# Altium schematic sheet GCM_SCH.SchDoc
size C; SheetNumber: 1; SheetTotal: 1
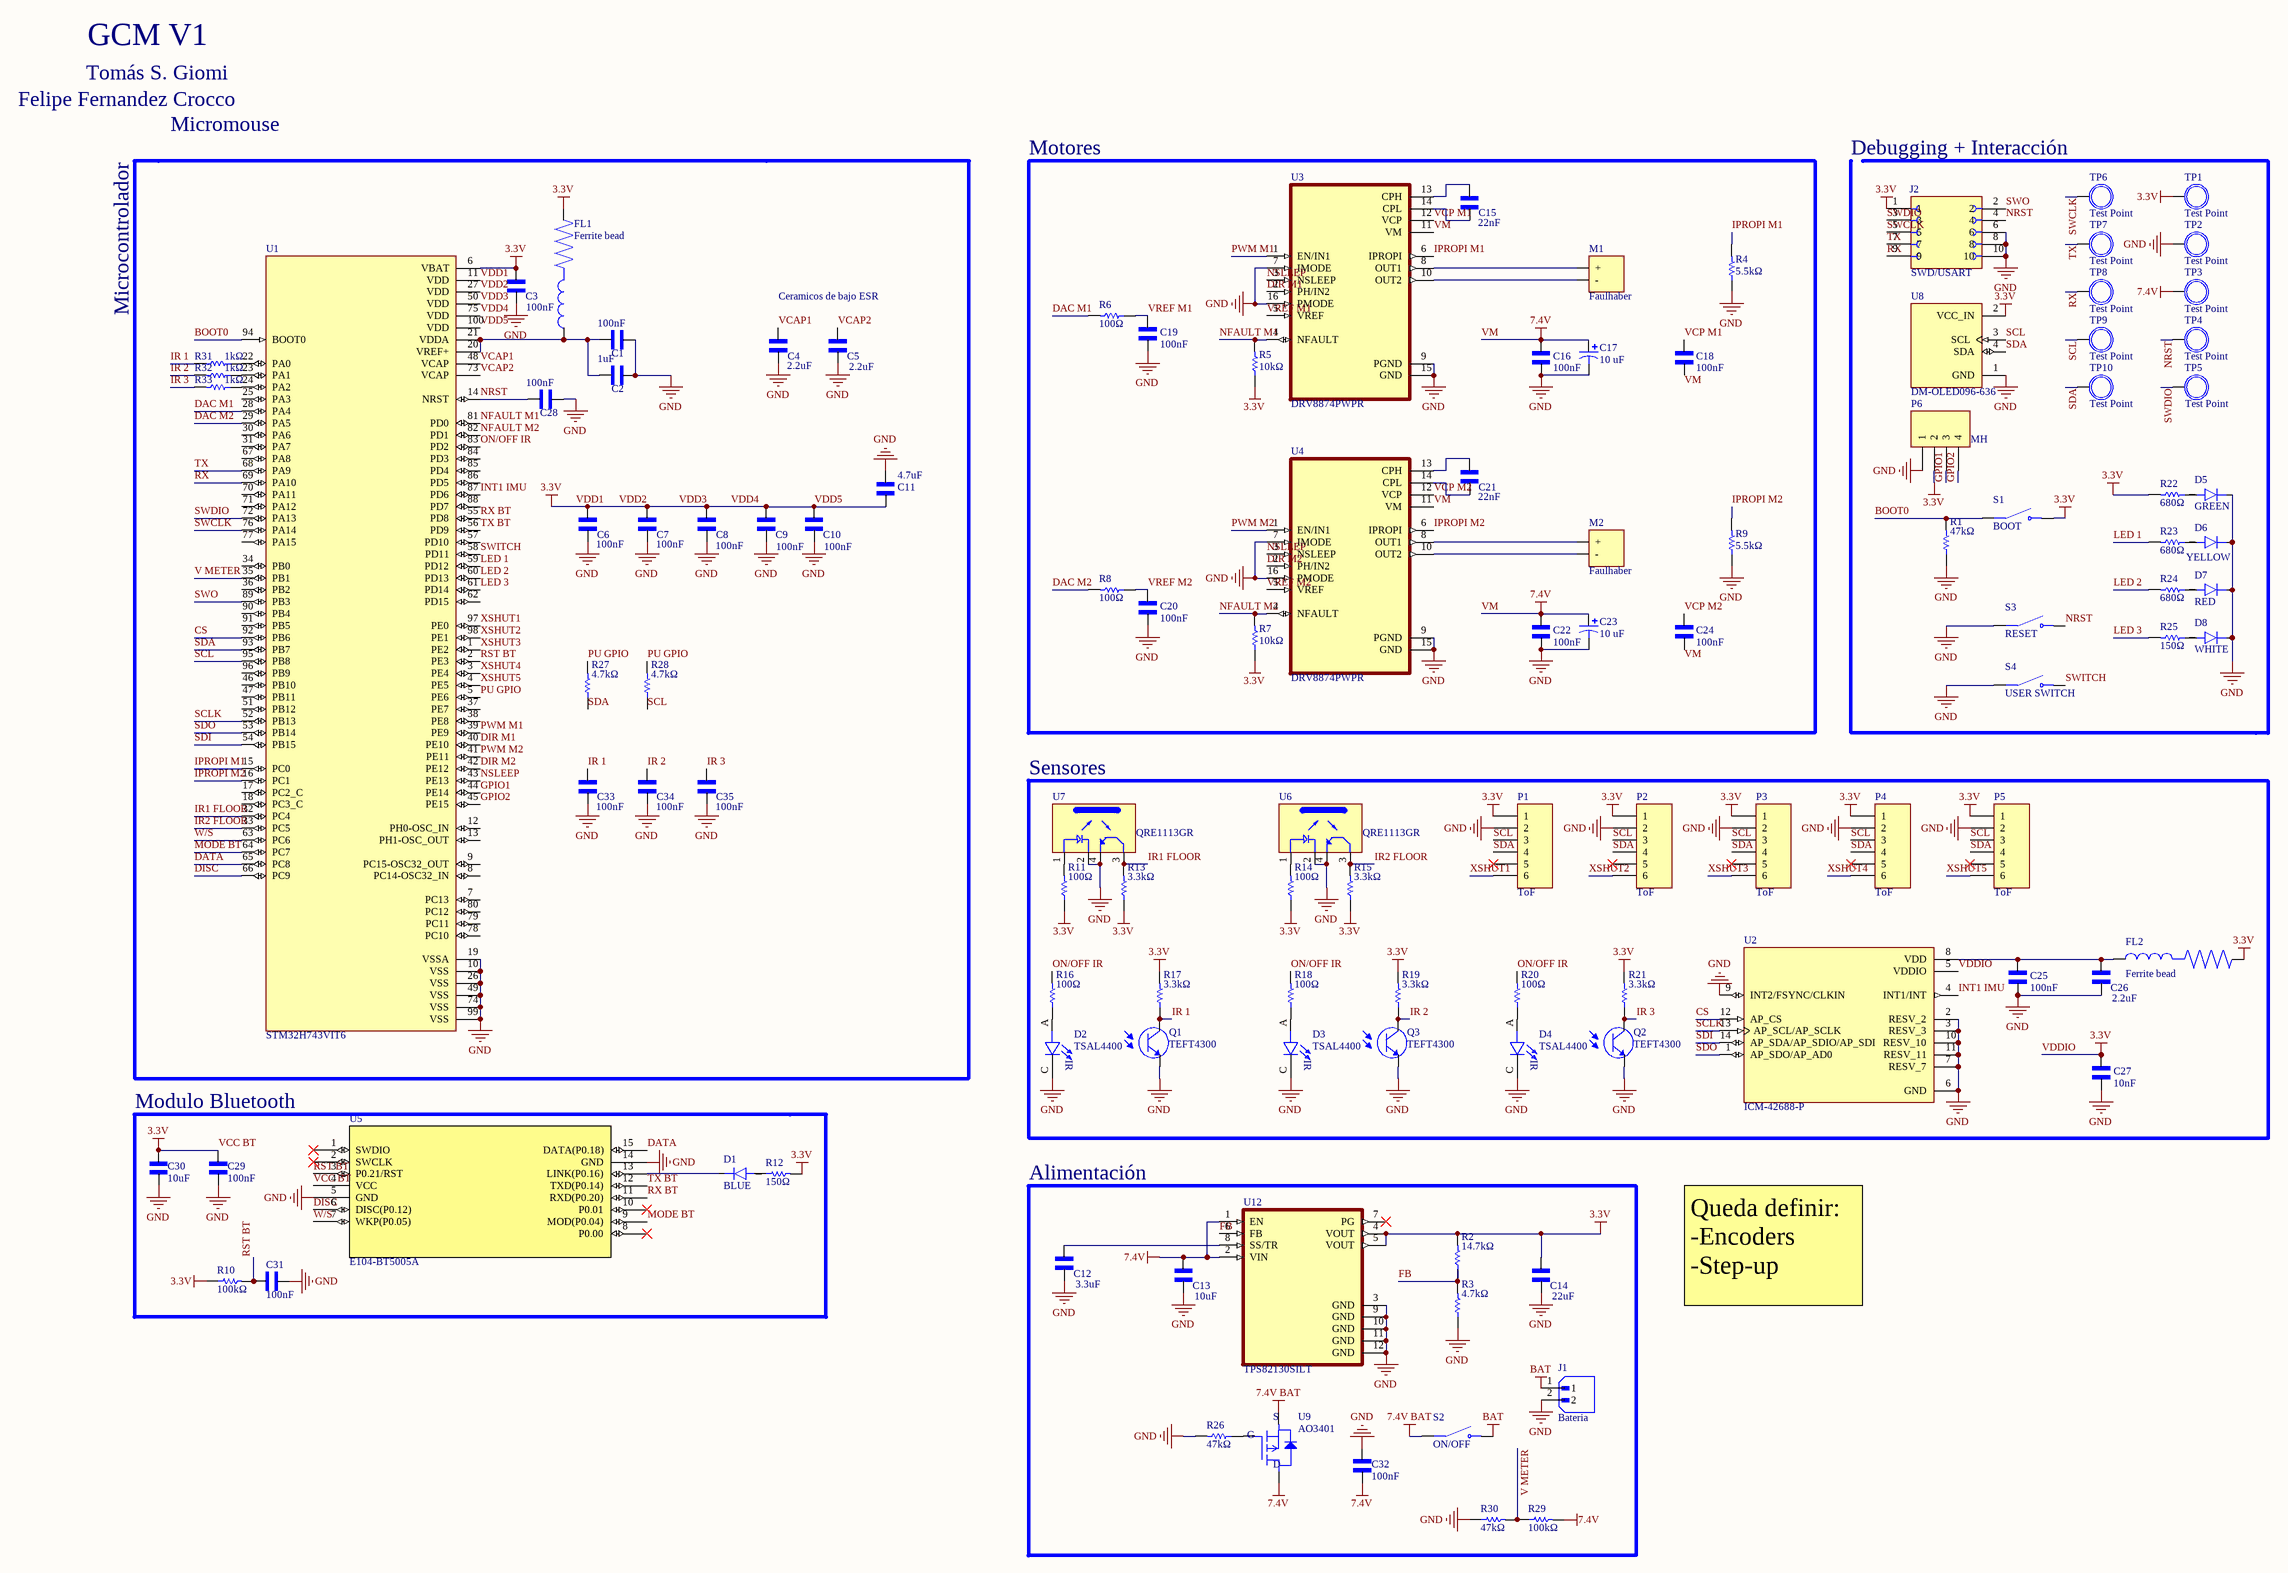
[diagram p0: GCM_SCH.SchDoc]

## Parts
C1  100nF  [CAPACITOR TANTALIO]
C2  1uF  [CAPACITOR TANTALIO]
C3  100nF  [CAPACITOR TANTALIO]
C4  2.2uF  [CAPACITOR TANTALIO]
C5  2.2uF  [CAPACITOR TANTALIO]
C6  100nF  [CAPACITOR TANTALIO]
C7  100nF  [CAPACITOR TANTALIO]
C8  100nF  [CAPACITOR TANTALIO]
C9  100nF  [CAPACITOR TANTALIO]
C10  100nF  [CAPACITOR TANTALIO]
C11  4.7uF  [CAPACITOR TANTALIO]
C12  3.3uF  [CAPACITOR TANTALIO]
C13  10uF  [CAPACITOR TANTALIO]
C14  22uF  [CAPACITOR TANTALIO]
C15  22nF  [CAPACITOR TANTALIO]
C16  100nF  [CAPACITOR TANTALIO]
C17  10 uF  [Cap El 10uF]
C18  100nF  [CAPACITOR TANTALIO]
C19  100nF  [CAPACITOR TANTALIO]
C20  100nF  [CAPACITOR TANTALIO]
C21  22nF  [CAPACITOR TANTALIO]
C22  100nF  [CAPACITOR TANTALIO]
C23  10 uF  [Cap El 10uF]
C24  100nF  [CAPACITOR TANTALIO]
C25  100nF  [CAPACITOR TANTALIO]
C26  2.2uF  [CAPACITOR TANTALIO]
C27  10nF  [CAPACITOR TANTALIO]
C28  100nF  [CAPACITOR TANTALIO]
C29  100nF  [CAPACITOR TANTALIO]
C30  10uF  [CAPACITOR TANTALIO]
C31  100nF  [CAPACITOR TANTALIO]
C32  100nF  [CAPACITOR TANTALIO]
C33  100nF  [CAPACITOR TANTALIO]
C34  100nF  [CAPACITOR TANTALIO]
C35  100nF  [CAPACITOR TANTALIO]
D1  BLUE  [LED SMD]
D2  TSAL4400  [LEDRD254W45D335H610]
D3  TSAL4400  [LEDRD254W45D335H610]
D4  TSAL4400  [LEDRD254W45D335H610]
D5  GREEN  [LED SMD]
D6  YELLOW  [LED SMD]
D7  RED  [LED SMD]
D8  WHITE  [LED SMD]
FL1  Ferrite bead  [BEADC1608X95N]
FL2  Ferrite bead  [BEADC1608X95N]
J1  Bateria  [JST_B2B-XH-A]
J2  SWD/USART  [AMPHENOL_20021311-00026T4LF]
M1  Faulhaber  [MOTOR]
M2  Faulhaber  [MOTOR]
P1  ToF  [FHDR1X6]
P2  ToF  [FHDR1X6]
P3  ToF  [FHDR1X6]
P4  ToF  [FHDR1X6]
P5  ToF  [FHDR1X6]
P6  MH  [FHDR1X4]
Q1  TEFT4300  [XDCR_TEFT4300]
Q2  TEFT4300  [XDCR_TEFT4300]
Q3  TEFT4300  [XDCR_TEFT4300]
R1  47kΩ  [RESISTENCIA SMD]
R2  14.7kΩ  [RESISTENCIA SMD]
R3  4.7kΩ  [RESISTENCIA SMD]
R4  5.5kΩ  [RESISTENCIA SMD]
R5  10kΩ  [RESISTENCIA SMD]
R6  100Ω  [RESISTENCIA SMD]
R7  10kΩ  [RESISTENCIA SMD]
R8  100Ω  [RESISTENCIA SMD]
R9  5.5kΩ  [RESISTENCIA SMD]
R10  100kΩ  [RESISTENCIA SMD]
R11  100Ω  [RESISTENCIA SMD]
R12  150Ω  [RESISTENCIA SMD]
R13  3.3kΩ  [RESISTENCIA SMD]
R14  100Ω  [RESISTENCIA SMD]
R15  3.3kΩ  [RESISTENCIA SMD]
R16  100Ω  [RESISTENCIA SMD]
R17  3.3kΩ  [RESISTENCIA SMD]
R18  100Ω  [RESISTENCIA SMD]
R19  3.3kΩ  [RESISTENCIA SMD]
R20  100Ω  [RESISTENCIA SMD]
R21  3.3kΩ  [RESISTENCIA SMD]
R22  680Ω  [RESISTENCIA SMD]
R23  680Ω  [RESISTENCIA SMD]
R24  680Ω  [RESISTENCIA SMD]
R25  150Ω  [RESISTENCIA SMD]
R26  47kΩ  [RESISTENCIA SMD]
R27  4.7kΩ  [RESISTENCIA SMD]
R28  4.7kΩ  [RESISTENCIA SMD]
R29  100kΩ  [RESISTENCIA SMD]
R30  47kΩ  [RESISTENCIA SMD]
R31  1kΩ  [RESISTENCIA SMD]
R32  1kΩ  [RESISTENCIA SMD]
R33  1kΩ  [RESISTENCIA SMD]
S1  BOOT  [SW_TS09-63-25-WT-160-SMT-TR]
S2  ON/OFF  [SW_L101011ML04Q]
S3  RESET  [SW_TS09-63-25-WT-160-SMT-TR]
S4  USER SWITCH  [SW_TS09-63-25-WT-160-SMT-TR]
TP1  Test Point  [TestPoint]  (no BOM)
TP2  Test Point  [TestPoint]  (no BOM)
TP3  Test Point  [TestPoint]  (no BOM)
TP4  Test Point  [TestPoint]  (no BOM)
TP5  Test Point  [TestPoint]  (no BOM)
TP6  Test Point  [TestPoint]  (no BOM)
TP7  Test Point  [TestPoint]  (no BOM)
TP8  Test Point  [TestPoint]  (no BOM)
TP9  Test Point  [TestPoint]  (no BOM)
TP10  Test Point  [TestPoint]  (no BOM)
U1  STM32H743VIT6  [QFP50P1600X1600X160-100N]
U2  ICM-42688-P  [PQFN50P300X250X97-14N]
U3  DRV8874PWPR  [SOP65P640X120-17N]
U4  DRV8874PWPR  [SOP65P640X120-17N]
U5  E104-BT5005A  [MOD15_E104-BT5005A_BYT]
U6  QRE1113GR  [SOIC180P460X187-4N]
U7  QRE1113GR  [SOIC180P460X187-4N]
U8  DM-OLED096-636  [MODULE_DM-OLED096-636]
U9  AO3401  [SOT23]
U12  TPS82130SILT  [CONV_TPS82140SILR]

## Blocks framed on the sheet
Motores: C15-C24 M1 M2 R4-R9 U3 U4
Sensores: C25-C27 D2-D4 FL2 P1-P5 Q1-Q3 R11 R13-R21 U2 U6 U7
Modulo Bluetooth: C29-C31 D1 R10 R12 U5
Alimentación: C12-C14 C32 J1 R2 R3 R26 R29 R30 S2 U9 U12

## Nets
7.4V BAT: S2.1(COM) U9.2(S)
BAT: J1.1 S2.2(NO)
GND: C1.2 C2.2 C3.1 C4.1 C5.1 C6.1 C7.1 C8.1 C9.1 C10.1 C11.2 C12.1 C13.1 C14.1 C16.1 C17.2 C19.1 C20.1 C22.1 C23.2 C25.1 C26.1 C27.1 C28.2 C29.1 C30.1 C31.1 C32.1 C33.1 C34.1 C35.1 D2.C D3.C D4.C D5.C D6.C D7.C D8.C J1.2 J2.6 J2.8 J2.10 P1.2 P2.2 P3.2 P4.2 P5.2 P6.1 Q1.E Q2.E Q3.E R1.1 R3.1 R4.1 R9.1 R26.2 R30.1 S3.1 S4.1 TP2.1 U1.10(VSS) U1.19(VSSA) U1.26(VSS) U1.49(VSS) U1.74(VSS) U1.99(VSS) U2.2(RESV_2) U2.3(RESV_3) U2.6(GND) U2.7(RESV_7) U2.9(INT2/FSYNC/CLKIN) U2.10(RESV_10) U2.11(RESV_11) U3.7(IMODE) U3.9(PGND) U3.15(GND) U3.16(PMODE) U4.7(IMODE) U4.9(PGND) U4.15(GND) U4.16(PMODE) U5.5(GND) U5.14(GND) U6.2(C) U6.4(ET) U7.2(C) U7.4(ET) U8.1(GND) U12.3(GND) U12.9(GND) U12.10(GND) U12.11(GND) U12.12(GND)
VCC BT: C3.2 C6.2 C7.2 C8.2 C9.2 C10.2 C11.1 C14.2 C27.2 C29.2 C30.2 FL1.2 FL2.2 J2.1 P1.1 P2.1 P3.1 P4.1 P5.1 P6.2 R2.2 R5.1 R7.1 R10.1 R11.1 R12.2 R13.1 R14.1 R15.1 R17.2 R19.2 R21.2 R22.2 S1.2 TP1.1 U1.6(VBAT) U1.11(VDD) U1.27(VDD) U1.50(VDD) U1.75(VDD) U1.100(VDD) U2.5(VDDIO) U5.4(VCC) U8.2(VCC_IN) U12.4(VOUT) U12.5(VOUT)  [also labelled 3.3V, VDD1, VDD2, VDD3, VDD4, VDD5, VDDIO]
VM: C13.2 C16.2 C17.1 C22.2 C23.1 C32.2 R29.2 TP3.1 U3.11(VM) U4.11(VM) U9.3(D) U12.1(EN) U12.2(VIN)  [also labelled 7.4V]
BOOT0: R1.2 S1.1 U1.94(BOOT0)
CS: U1.92(PB6) U2.12(AP_CS)
DAC M1: R6.2 U1.28(PA4)
DAC M2: R8.2 U1.29(PA5)
DATA: U1.65(PC8) U5.15(DATA(P0.18))
DIR M1: U1.40(PE10) U3.2(PH/IN2)
DIR M2: U1.42(PE12) U4.2(PH/IN2)
DISC: U1.66(PC9) U5.6(DISC(P0.12))
FB: R2.1 R3.2 U12.6(FB)
GPIO1: P6.3 U1.44(PE14)
GPIO2: P6.4 U1.45(PE15)
INT1 IMU: U1.87(PD6) U2.4(INT1/INT)
IPROPI M1: R4.2 U1.15(PC0) U3.6(IPROPI)
IPROPI M2: R9.2 U1.16(PC1) U4.6(IPROPI)
IR1 FLOOR: R13.2 U1.32(PC4) U7.3(CT)
IR2 FLOOR: R15.2 U1.33(PC5) U6.3(CT)
IR 1: C33.2 Q1.C R17.1 R31.2
IR 2: C34.2 Q3.C R19.1 R32.2
IR 3: C35.2 Q2.C R21.1 R33.2
LED 1: R23.2 U1.59(PD12)
LED 2: R24.2 U1.60(PD13)
LED 3: R25.2 U1.61(PD14)
MODE BT: U1.64(PC7) U5.9(MOD(P0.04))
NFAULT M1: R5.2 U1.81(PD0) U3.4(NFAULT)
NFAULT M2: R7.2 U1.82(PD1) U4.4(NFAULT)
NRST: C28.1 J2.4 S3.2 TP4.1 U1.14(NRST)
NSLEEP: U1.43(PE13) U3.3(NSLEEP) U4.3(NSLEEP)
ON/OFF IR: R16.2 R18.2 R20.2 U1.83(PD2)
PU GPIO: R27.2 R28.2 U1.5(PE6)
PWM M1: U1.39(PE9) U3.1(EN/IN1)
PWM M2: U1.41(PE11) U4.1(EN/IN1)
RST BT: C31.2 R10.2 U1.2(PE3) U5.3(P0.21/RST)
RX: J2.9 TP8.1 U1.69(PA10)
RX BT: U1.55(PD8) U5.11(RXD(P0.20))
SCL: P1.3 P2.3 P3.3 P4.3 P5.3 R28.1 TP9.1 U1.95(PB8) U8.3(SCL)
SCLK: U1.52(PB13) U2.13(AP_SCL/AP_SCLK)
SDA: P1.4 P2.4 P3.4 P4.4 P5.4 R27.1 TP10.1 U1.93(PB7) U8.4(SDA)
SDI: U1.54(PB15) U2.14(AP_SDA/AP_SDIO/AP_SDI)
SDO: U1.53(PB14) U2.1(AP_SDO/AP_AD0)
SWCLK: J2.5 TP6.1 U1.76(PA14)
SWDIO: J2.3 TP5.1 U1.72(PA13)
SWITCH: S4.2 U1.58(PD11)
SWO: J2.2 U1.89(PB3)
TX: J2.7 TP7.1 U1.68(PA9)
TX BT: U1.56(PD9) U5.12(TXD(P0.14))
V METER: R29.1 R30.2 U1.35(PB1)
VCAP1: C4.2 U1.48(VCAP)
VCAP2: C5.2 U1.73(VCAP)
VCP M1: C18.2 U3.12(VCP)
VCP M2: C24.2 U4.12(VCP)
VREF M1: C19.2 R6.1 U3.5(VREF)
VREF M2: C20.2 R8.1 U4.5(VREF)
W/S: U1.63(PC6) U5.7(WKP(P0.05))
XSHUT1: P1.6 U1.97(PE0)
XSHUT2: P2.6 U1.98(PE1)
XSHUT3: P3.6 U1.1(PE2)
XSHUT4: P4.6 U1.3(PE4)
XSHUT5: P5.6 U1.4(PE5)
NetC1_1: C1.1 C2.1 FL1.1 U1.20(VREF+) U1.21(VDDA)
NetC12_2: C12.2 U12.8(SS/TR)
NetC15_1: C15.1 U3.14(CPL)
NetC15_2: C15.2 U3.13(CPH)
NetC21_1: C21.1 U4.14(CPL)
NetC21_2: C21.2 U4.13(CPH)
NetC25_2: C25.2 C26.2 FL2.1 U2.8(VDD)
NetD1_C: D1.C U5.13(LINK(P0.16))
NetD2_A: D2.A R16.1
NetD3_A: D3.A R18.1
NetD4_A: D4.A R20.1
NetM1_1: M1.1(+) U3.8(OUT1)
NetM1_2: M1.2(-) U3.10(OUT2)
NetM2_1: M2.1(+) U4.8(OUT1)
NetM2_2: M2.2(-) U4.10(OUT2)
NetR11_2: R11.2 U7.1(A)
NetR14_2: R14.2 U6.1(A)
NetR26_1: R26.1 U9.1(G)
NetR31_1: R31.1 U1.22(PA0)
NetR32_1: R32.1 U1.23(PA1)
NetR33_1: R33.1 U1.24(PA2)

Not connected (* = marked no-connect by the designer): C18 1; C24 1; D1 A; D5 A; D6 A; D7 A; D8 A; P1 5*; P2 5*; P3 5*; P4 5*; P5 5*; R12 1; R22 1; R23 1; R24 1; R25 1; U1 7(PC13) 8(PC14-OSC32_IN) 9(PC15-OSC32_OUT) 12(PH0-OSC_IN) 13(PH1-OSC_OUT) 17(PC2_C) 18(PC3_C) 25(PA3) 30(PA6) 31(PA7) 34(PB0) 36(PB2) 37(PE7) 38(PE8) 46(PB10) 47(PB11) 51(PB12) 57(PD10) 62(PD15) 67(PA8) 70(PA11) 71(PA12) 77(PA15) 78(PC10) 79(PC11) 80(PC12) 84(PD3) 85(PD4) 86(PD5) 88(PD7) 90(PB4) 91(PB5) 96(PB9); U5 1(SWDIO)* 2(SWCLK)* 8(P0.00)* 10(P0.01)*; U12 7(PG)*

## Notes on the sheet
- Tomás S. Giomi
- GCM V1
- Felipe Fernandez Crocco
- Micromouse
- Debugging + Interacción
- Microcontrolador
- Ceramicos de bajo ESR
- Queda definir:
  -Encoders
  -Step-up
- Labels drawn without touching a wire or pin: VM
- (in symbol TSAL4400) IR

## Library data of the parts
C1-C16 C18-C22 C24-C35 = CAPACITOR TANTALIO: 0805; MP: GRM035R60J475ME15D; MF: Murata; Value: *; DigiKey-Purchase-URL: https://snapeda.com/shop?store=DigiKey&id=1181520; Package: 0603 Murata; SnapEDA_Link: https://www.snapeda.com/parts/GRM035R60J475ME15D/Murata%20Electronics%20North%20America/view-part/1181520/?ref=snap; Mouser-Purchase-URL: https://snapeda.com/shop?store=Mouser&id=1181520; Digi-Key_Part_Number: 490-13230-1-ND
C17 C23 = Cap el 10 uF
D1 D5-D8 = LED SMD: 0805; MP: 597-5311-402F; Package: None; Price: None; Value: *; Availability: Unavailable
D2-D4 = TSAL4400: Infrared Emitter 940nm 36mW/sr Circular Top Mount 2-Pin T-1 Bulk; MF: Vishay Semiconductor; Package: Radial Vishay; Price: None; SnapEDA_Link: https://www.snapeda.com/parts/TSAL4400/Vishay%20Semiconductor%20Opto%20Division/view-part/3623381/?ref=snap; Value: *; MP: TSAL4400; Availability: Unavailable
FL1 FL2 = BLM18AG601SN1D: 600 Ohms @ 100 MHz 1 - Ferrite Bead 0603 (1608 Metric) 500mA 380mOhm; MF: Murata; Check_prices: https://www.snapeda.com/parts/BLM18AG601SN1D/Murata/view-part/?ref=eda; SnapEDA_Link: https://www.snapeda.com/parts/BLM18AG601SN1D/Murata/view-part/?ref=snap; Availability: In Stock; Value: *; Price: None; MP: BLM18AG601SN1D; Package: 1608 Murata; Purchase-URL: https://pricing.snapeda.com/search/part/BLM18AG601SN1D/?ref=eda
J1 = B2B-XH-A: MF: {'manufacturer': u'JST Sales America Inc.'}; Package: None; Price: None; Value: *; MP: B2B-XH-A; Availability: Unavailable
J2 = 20021311-00026T4LF: MF: Amphenol ICC; Package: None; Price: None; Value: *; MP: 20021311-00026T4LF; Availability: Unavailable
P1-P5 = FHeader 6X1: LatestRevisionDate: 17-Jul-2002; LatestRevisionNote: Re-released for DXP Platform.; Publisher: Altium Limited
P6 = FHeader 4X1_1: LatestRevisionDate: 17-Jul-2002; LatestRevisionNote: Re-released for DXP Platform.; Publisher: Altium Limited
Q1-Q3 = TEFT4300: Phototransistors 925nm Top View Radial, 3mm Dia (T-1); MF: Vishay Semiconductor; SnapEDA_Link: https://www.snapeda.com/parts/TEFT4300/Vishay/view-part/?ref=snap; Package: None; Value: *; MP: TEFT4300; Check_prices: https://www.snapeda.com/parts/TEFT4300/Vishay/view-part/?ref=eda
R1-R33 = RESISTENCIA: 0805; Value: 3KΩ; Published: 8-Jun-2000; LatestRevisionDate: 17-Jul-2002; LatestRevisionNote: Re-released for DXP Platform.; PackageReference: AXIAL-0.3; Publisher: Altium Limited; PackageDescription: Axial Device, Thru-Hole; 2 Leads; 0.3 in Pin Spacing
S1 S3 S4 = TS09-63-25-WT-160-SMT-TR: 6.1 x 3.7 mm, 2.5 mm Actuator Height, 160 gf, White, Surface Mount, SPST, Tactile Switch; MF: Same Sky; SnapEDA_Link: https://www.snapeda.com/parts/TS09-63-25-WT-160-SMT-TR/Same+Sky/view-part/?ref=snap; Package: None; Value: *; MP: TS09-63-25-WT-160-SMT-TR; Check_prices: https://www.snapeda.com/parts/TS09-63-25-WT-160-SMT-TR/Same+Sky/view-part/?ref=eda
S2 = L101011ML04Q: Switch Slide ON OFF SPST Side Slide 4A 250VAC 125VDC PC Pins Thru-Hole Bulk; MF: C&K; SnapEDA_Link: https://www.snapeda.com/parts/L101011ML04Q/C%2526K/view-part/?ref=snap; Package: None; Value: *; MP: L101011ML04Q; Check_prices: https://www.snapeda.com/parts/L101011ML04Q/C%2526K/view-part/?ref=eda
U1 = STM32H743VIT6: ARMÂ® CortexÂ®-M7 STM32H7 Microcontroller IC 32-Bit Single-Core 480MHz 2MB (2M x 8) FLASH 100-LQFP (14x14); MF: STMicroelectronics; SnapEDA_Link: https://www.snapeda.com/parts/STM32H743VIT6/STMicroelectronics/view-part/?ref=snap; Package: LQFP-100 STMicroelectronics; Value: *; MP: STM32H743VIT6; Check_prices: https://www.snapeda.com/parts/STM32H743VIT6/STMicroelectronics/view-part/?ref=eda
U2 = ICM-42688-P: Accelerometer, Gyroscope, 6 Axis Sensor Output; Package: None; MP: ICM-42688-P; Value: *; Availability: Unavailable; Price: None
U3 U4 = DRV8874PWPR: 40-V, 6-A H-bridge motor driver with integrated current sensing feedback; MF: Texas Instruments; SnapEDA_Link: https://www.snapeda.com/parts/DRV8874PWPR/Texas+Instruments/view-part/?ref=snap; Package: HTSSOP-16 Texas Instruments; Value: *; MP: DRV8874PWPR; Check_prices: https://www.snapeda.com/parts/DRV8874PWPR/Texas+Instruments/view-part/?ref=eda
U5 = E104-BT5005A: No Description Available; Manufacturer_Name: Chengdu Ebyte Elec Tech; Type: RF; Copyright: Copyright (C) 2026 Ultra Librarian. All rights reserved.; Manufacturer_Part_Number: E104-BT5005A; RefDes: RefDes
U6 U7 = QRE1113GR: Reflective Optical Sensor 0.039 (1mm) 4-SMD, Gull Wing; MF: ON Semiconductor; Package: ARUSM-313-4 ON Semiconductor; Price: None; Check_prices: https://www.snapeda.com/parts/QRE1113GR/Onsemi/view-part/?ref=eda; Value: *; SnapEDA_Link: https://www.snapeda.com/parts/QRE1113GR/Onsemi/view-part/?ref=snap; MP: QRE1113GR; Availability: In Stock; Purchase-URL: https://pricing.snapeda.com/search/part/QRE1113GR/?ref=eda
U8 = DM-OLED096-636: 0.96â€ 128 X 64 MONOCHROME GRAPHIC OLED DISPLAY MODULE - I2C; SnapEDA_Link: https://www.snapeda.com/parts/DM-OLED096-636/Display+Module/view-part/?ref=snap; Package: Package; Value: *; MF: Display Module; MP: DM-OLED096-636; Check_prices: https://www.snapeda.com/parts/DM-OLED096-636/Display+Module/view-part/?ref=eda
U9 = AO3401: P-Channel 30 V 4A (Ta) 1.4W (Ta) Surface Mount SOT-23-3; MF: Alpha & Omega Semiconductor; SnapEDA_Link: https://www.snapeda.com/parts/AO3401/Alpha/view-part/?ref=snap; Package: SOT-23-3 Alpha &amp; Omega Semiconductor; Value: *; MP: AO3401; Check_prices: https://www.snapeda.com/parts/AO3401/Alpha/view-part/?ref=eda
U12 = TPS82130SILT: Non-Isolated PoL Module DC DC Converter 1 Output 0.9 ~ 5V - - - 3A 3V - 17V Input; MF: Texas Instruments; SnapEDA_Link: https://www.snapeda.com/parts/TPS82130SIL/Texas+Instruments/view-part/?ref=snap; Package: None; Value: *; MP: TPS82130SIL; Check_prices: https://www.snapeda.com/parts/TPS82130SIL/Texas+Instruments/view-part/?ref=eda
M1 M2 = Faulhaber: LatestRevisionDate: 17-Jul-2002; LatestRevisionNote: Re-released for DXP Platform.; Publisher: Altium Limited